# Altium project qfc_Alfa2.0.PrjPcb
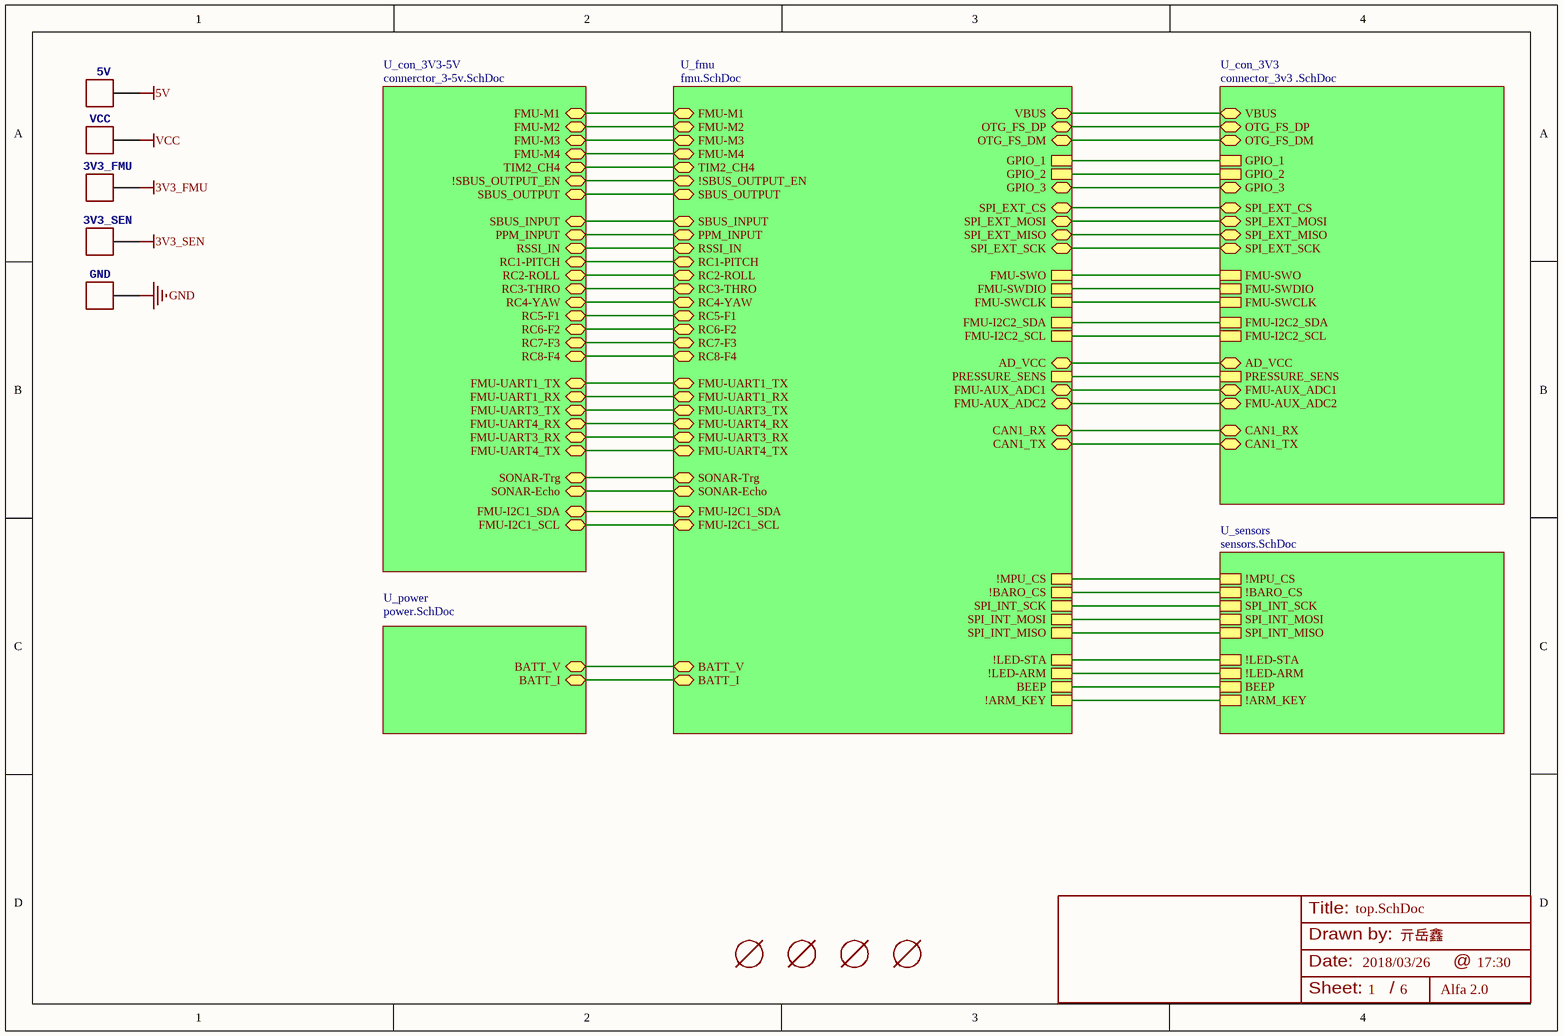
[diagram p0: top.SchDoc]
6 sheets, 137 parts. Net scope: hierarchical (ports join the sheet entries above them; power ports are global).
Board file: qfc_Alfa2.0.PcbDoc
Sheets:
  top.SchDoc
    U_fmu = fmu.SchDoc
    U_sensors = sensors.SchDoc
    U_power = power.SchDoc
    U_con_3V3 = connector_3v3 .SchDoc
    U_con_3V3-5V = connerctor_3-5v.SchDoc

## Sheet top.SchDoc: myA4
size A4; Date: 2018/03/26; DrawnBy: 亓岳鑫; Organization: Altium Limited; Address1: 3 Minna Close; Address2: Belrose; Address3: NSW 2085; Address4: Australia; DocumentNumber: 1; Revision: Alfa 2.0; SheetNumber: 1; SheetTotal: 6; Time: 17:30

### Parts
3V3_FMU  TEST  [PAD.04X.04]  (value not drawn)
3V3_SEN  TEST  [PAD.04X.04]  (value not drawn)
5V  TEST  [PAD.04X.04]  (value not drawn)
GND  TEST  [PAD.04X.04]  (value not drawn)
M101  MOUNT-HOLE3MM  [HOLE-3mm]  (value not drawn)
M102  MOUNT-HOLE3MM  [HOLE-3mm]  (value not drawn)
M103  MOUNT-HOLE3MM  [HOLE-3mm]  (value not drawn)
M104  MOUNT-HOLE3MM  [HOLE-3mm]  (value not drawn)
VCC  TEST  [PAD.04X.04]  (value not drawn)

### Sub-sheets
U_con_3V3 = connector_3v3 .SchDoc: FMU-SWCLK, FMU-SWDIO, FMU-SWO, GPIO_1, OTG_FS_DP, OTG_FS_DM, GPIO_2, VBUS, SPI_EXT_MOSI, SPI_EXT_MISO, SPI_EXT_SCK, CAN1_RX, CAN1_TX, SPI_EXT_CS, PRESSURE_SENS, FMU-I2C2_SDA, FMU-I2C2_SCL, FMU-AUX_ADC1, FMU-AUX_ADC2, AD_VCC, GPIO_3
U_con_3V3-5V = connerctor_3-5v.SchDoc: FMU-M1, FMU-M2, FMU-M3, FMU-M4, PPM_INPUT, SBUS_INPUT, SBUS_OUTPUT, !SBUS_OUTPUT_EN, RSSI_IN, FMU-UART1_TX, FMU-UART1_RX, FMU-UART3_TX, FMU-UART4_RX, FMU-UART3_RX, FMU-UART4_TX, RC5-F1, RC3-THRO, RC1-PITCH, RC4-YAW, RC2-ROLL, RC6-F2, RC7-F3, RC8-F4, SONAR-Echo, TIM2_CH4, FMU-I2C1_SDA, FMU-I2C1_SCL, SONAR-Trg
U_fmu = fmu.SchDoc: BATT_I, BATT_V, FMU-M1, FMU-M2, FMU-M3, FMU-M4, PPM_INPUT, SBUS_INPUT, SBUS_OUTPUT, !SBUS_OUTPUT_EN, RSSI_IN, FMU-UART1_TX, FMU-UART1_RX, FMU-UART3_TX, FMU-UART4_RX, FMU-UART3_RX, FMU-UART4_TX, RC5-F1, RC3-THRO, RC1-PITCH, RC4-YAW, RC2-ROLL, RC6-F2, RC7-F3, RC8-F4, SONAR-Echo, TIM2_CH4, FMU-I2C1_SDA, FMU-I2C1_SCL, SONAR-Trg, FMU-SWCLK, FMU-SWDIO, FMU-SWO, GPIO_1, OTG_FS_DP, OTG_FS_DM, GPIO_2, VBUS, SPI_EXT_MOSI, SPI_EXT_MISO, SPI_EXT_SCK, CAN1_RX, CAN1_TX, SPI_EXT_CS, PRESSURE_SENS, FMU-I2C2_SDA, FMU-I2C2_SCL, FMU-AUX_ADC1, FMU-AUX_ADC2, AD_VCC, GPIO_3, !MPU_CS, !BARO_CS, SPI_INT_SCK, SPI_INT_MOSI, SPI_INT_MISO, !LED-STA, !LED-ARM, !ARM_KEY, BEEP
U_power = power.SchDoc: BATT_I, BATT_V
U_sensors = sensors.SchDoc: !MPU_CS, !BARO_CS, SPI_INT_SCK, SPI_INT_MOSI, SPI_INT_MISO, !LED-STA, !LED-ARM, !ARM_KEY, BEEP

### Nets
3V3_FMU: 3V3_FMU.P$1
3V3_SEN: 3V3_SEN.P$1
5V: 5V.P$1
GND: GND.P$1
VCC: VCC.P$1
PPM_INPUT: sheet U_fmu/PPM_INPUT, sheet U_con_3V3-5V/PPM_INPUT
SPI1_MISO: sheet U_fmu/SPI_INT_SCK, sheet U_sensors/SPI_INT_SCK
SPI1_MOSI: sheet U_fmu/SPI_INT_MOSI, sheet U_sensors/SPI_INT_MOSI
SPI1_SCK: sheet U_fmu/SPI_INT_MISO, sheet U_sensors/SPI_INT_MISO
NetC501_P$1: sheet U_fmu/AD_VCC, sheet U_con_3V3/AD_VCC
NetC502_P$1: sheet U_fmu/PRESSURE_SENS, sheet U_con_3V3/PRESSURE_SENS
NetC503_P$1: sheet U_fmu/FMU-AUX_ADC1, sheet U_con_3V3/FMU-AUX_ADC1
NetC504_P$1: sheet U_fmu/FMU-AUX_ADC2, sheet U_con_3V3/FMU-AUX_ADC2
NetD501_C: sheet U_fmu/VBUS, sheet U_con_3V3/VBUS
NetJ502_1: sheet U_fmu/SPI_EXT_CS, sheet U_con_3V3/SPI_EXT_CS
NetJ502_2: sheet U_fmu/SPI_EXT_MOSI, sheet U_con_3V3/SPI_EXT_MOSI
NetJ502_3: sheet U_fmu/SPI_EXT_MISO, sheet U_con_3V3/SPI_EXT_MISO
NetJ502_4: sheet U_fmu/SPI_EXT_SCK, sheet U_con_3V3/SPI_EXT_SCK
NetJ505_2: sheet U_fmu/FMU-SWCLK, sheet U_con_3V3/FMU-SWCLK
NetJ505_3: sheet U_fmu/FMU-SWO, sheet U_con_3V3/FMU-SWO
NetJ505_4: sheet U_fmu/FMU-SWDIO, sheet U_con_3V3/FMU-SWDIO
NetJ506_1: sheet U_fmu/GPIO_1, sheet U_con_3V3/GPIO_1
NetJ506_2: sheet U_fmu/GPIO_2, sheet U_con_3V3/GPIO_2
NetJ506_3: sheet U_fmu/GPIO_3, sheet U_con_3V3/GPIO_3
NetJ602_1: sheet U_fmu/SONAR-Trg, sheet U_con_3V3-5V/SONAR-Trg
NetR201_2: sheet U_fmu/BATT_V, sheet U_power/BATT_V
NetR202_2: sheet U_fmu/BATT_I, sheet U_power/BATT_I
NetR301_1: sheet U_fmu/!ARM_KEY, sheet U_sensors/!ARM_KEY
NetR302_1: sheet U_fmu/!LED-ARM, sheet U_sensors/!LED-ARM
NetR303_1: sheet U_fmu/!LED-STA, sheet U_sensors/!LED-STA
NetR306_2: sheet U_fmu/BEEP, sheet U_sensors/BEEP
NetR502_1: sheet U_fmu/FMU-I2C2_SCL, sheet U_con_3V3/FMU-I2C2_SCL
NetR503_1: sheet U_fmu/OTG_FS_DM, sheet U_con_3V3/OTG_FS_DM
NetR504_1: sheet U_fmu/FMU-I2C2_SDA, sheet U_con_3V3/FMU-I2C2_SDA
NetR505_1: sheet U_fmu/OTG_FS_DP, sheet U_con_3V3/OTG_FS_DP
NetR604_1: sheet U_fmu/RSSI_IN, sheet U_con_3V3-5V/RSSI_IN
NetU301_8: sheet U_fmu/!MPU_CS, sheet U_sensors/!MPU_CS
NetU302_5: sheet U_fmu/!BARO_CS, sheet U_sensors/!BARO_CS
NetU401_23: sheet U_fmu/FMU-UART4_TX, sheet U_con_3V3-5V/FMU-UART4_TX
NetU401_24: sheet U_fmu/FMU-UART4_RX, sheet U_con_3V3-5V/FMU-UART4_RX
NetU401_25: sheet U_fmu/SONAR-Echo, sheet U_con_3V3-5V/SONAR-Echo
NetU401_26: sheet U_fmu/TIM2_CH4, sheet U_con_3V3-5V/TIM2_CH4
NetU401_35: sheet U_fmu/RC3-THRO, sheet U_con_3V3-5V/RC3-THRO
NetU401_36: sheet U_fmu/RC4-YAW, sheet U_con_3V3-5V/RC4-YAW
NetU401_40: sheet U_fmu/FMU-M1, sheet U_con_3V3-5V/FMU-M1
NetU401_42: sheet U_fmu/FMU-M2, sheet U_con_3V3-5V/FMU-M2
NetU401_44: sheet U_fmu/FMU-M3, sheet U_con_3V3-5V/FMU-M3
NetU401_45: sheet U_fmu/FMU-M4, sheet U_con_3V3-5V/FMU-M4
NetU401_55: sheet U_fmu/FMU-UART3_TX, sheet U_con_3V3-5V/FMU-UART3_TX
NetU401_56: sheet U_fmu/FMU-UART3_RX, sheet U_con_3V3-5V/FMU-UART3_RX
NetU401_59: sheet U_fmu/RC5-F1, sheet U_con_3V3-5V/RC5-F1
NetU401_60: sheet U_fmu/RC6-F2, sheet U_con_3V3-5V/RC6-F2
NetU401_61: sheet U_fmu/RC7-F3, sheet U_con_3V3-5V/RC7-F3
NetU401_62: sheet U_fmu/RC8-F4, sheet U_con_3V3-5V/RC8-F4
NetU401_81: sheet U_fmu/CAN1_RX, sheet U_con_3V3/CAN1_RX
NetU401_82: sheet U_fmu/CAN1_TX, sheet U_con_3V3/CAN1_TX
NetU401_84: sheet U_fmu/!SBUS_OUTPUT_EN, sheet U_con_3V3-5V/!SBUS_OUTPUT_EN
NetU401_86: sheet U_fmu/SBUS_OUTPUT, sheet U_con_3V3-5V/SBUS_OUTPUT
NetU401_87: sheet U_fmu/SBUS_INPUT, sheet U_con_3V3-5V/SBUS_INPUT
NetU401_90: sheet U_fmu/RC1-PITCH, sheet U_con_3V3-5V/RC1-PITCH
NetU401_91: sheet U_fmu/RC2-ROLL, sheet U_con_3V3-5V/RC2-ROLL
NetU401_92: sheet U_fmu/FMU-UART1_TX, sheet U_con_3V3-5V/FMU-UART1_TX
NetU401_93: sheet U_fmu/FMU-UART1_RX, sheet U_con_3V3-5V/FMU-UART1_RX
NetU401_95: sheet U_fmu/FMU-I2C1_SCL, sheet U_con_3V3-5V/FMU-I2C1_SCL
NetU401_96: sheet U_fmu/FMU-I2C1_SDA, sheet U_con_3V3-5V/FMU-I2C1_SDA

### Notes on the sheet
- Title:
- Drawn by:
- Date:
- @
- Sheet:
- /

### Library data of the parts
3V3_FMU 3V3_SEN 5V GND VCC = TEST: BOM: EXCLUDE; PARTNO: *
M101-M104 = MOUNT-HOLE3MM: BOM: EXCLUDE; PARTNO: *

## Sheet fmu.SchDoc: myA4
size A4; Date: 2018/03/30; DrawnBy: 亓岳鑫; Organization: Altium Limited; Address1: 3 Minna Close; Address2: Belrose; Address3: NSW 2085; Address4: Australia; DocumentNumber: 4; Revision: Alfa 2.0; SheetNumber: 4; SheetTotal: 6; Time: 17:30
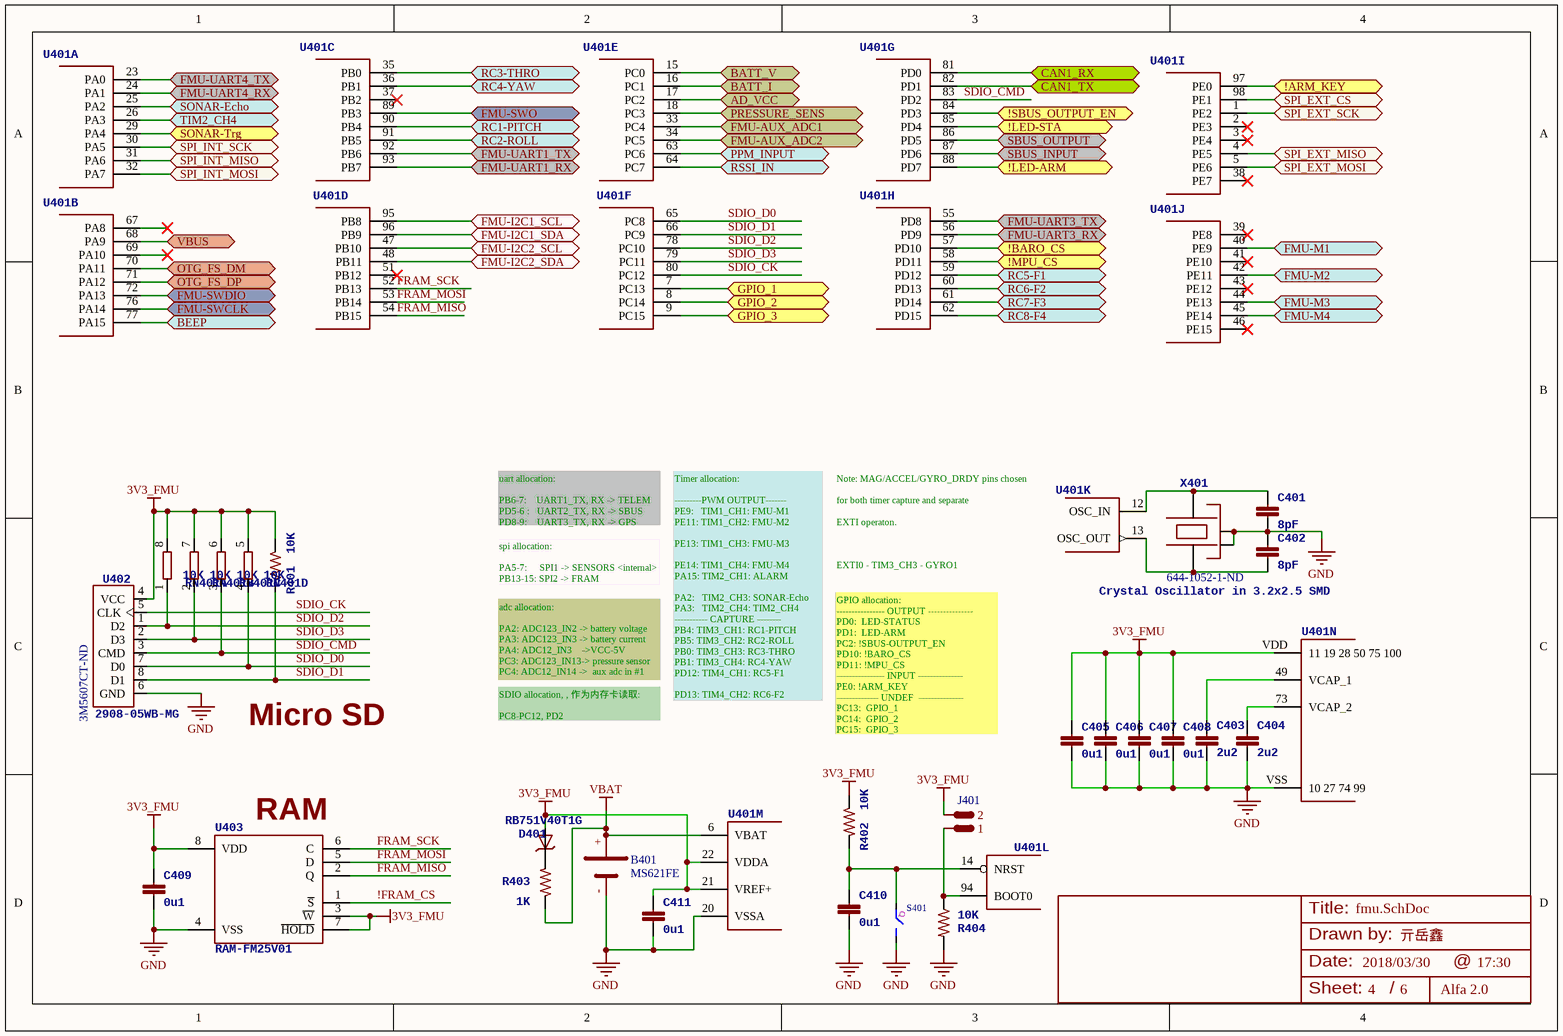
[diagram p1: fmu.SchDoc]

### Parts
B401  MS621FE  [MS621FE]
C401  8pF  [0603-CAP]
C402  8pF  [0603-CAP]
C403  2u2  [0603-CAP]
C404  2u2  [0603-CAP]
C405  0u1  [0603-CAP]
C406  0u1  [0603-CAP]
C407  0u1  [0603-CAP]
C408  0u1  [0603-CAP]
C409  0u1  [0603-CAP]
C410  0u1  [0603-CAP]
C411  0u1  [0603-CAP]
D401  RB751V40T1G  [SOD-323]
J401  HDR 2X1  [HDR2X1]  (value not drawn)
R401  10K  [0603-RES]
R402  10K  [0603-RES]
R403  1K  [0603-RES]
R404  10K  [0603-RES]
RN401  10K  [0603*4]  (parts A,B,C,D of 4)
S401  轻触开关 贴片3*6*2.5mm  [SMD-SWITCH-2P]  (value not drawn)
U401  STM32F427VI qfp 100 pin  [LQFP100]  (value not drawn)  (parts A,B,C,D,E,F,G,H,I,J,K,L,M,N of 14)
U402  2908-05WB-MG  Supplier Part Number 1: 3M5607CT-ND  [MICROSD]
U403  RAM-FM25V01  [SO08]
X401  Crystal Oscillator in 3.2x2.5 SMD  Supplier Part Number 1: 644-1052-1-ND  [3225-OSC]

### Ports
!ARM_KEY, !BARO_CS, !LED-ARM, !LED-STA, !MPU_CS, !SBUS_OUTPUT_EN, AD_VCC, BATT_I, BATT_V, BEEP, CAN1_RX, CAN1_TX, FMU-AUX_ADC1, FMU-AUX_ADC2, FMU-I2C1_SCL, FMU-I2C1_SDA, FMU-I2C2_SCL, FMU-I2C2_SDA, FMU-M1, FMU-M2, FMU-M3, FMU-M4, FMU-SWCLK, FMU-SWDIO, FMU-SWO, FMU-UART1_RX, FMU-UART1_TX, FMU-UART3_RX, FMU-UART3_TX, FMU-UART4_RX, FMU-UART4_TX, GPIO_1, GPIO_2, GPIO_3, OTG_FS_DM, OTG_FS_DP, PPM_INPUT, PRESSURE_SENS, RC1-PITCH, RC2-ROLL, RC3-THRO, RC4-YAW, RC5-F1, RC6-F2, RC7-F3, RC8-F4, RSSI_IN, SBUS_INPUT, SBUS_OUTPUT, SONAR-Echo, SONAR-Trg, SPI_EXT_CS, SPI_EXT_MISO, SPI_EXT_MOSI, SPI_EXT_SCK, SPI_INT_MISO, SPI_INT_MOSI, SPI_INT_SCK, TIM2_CH4, VBUS

### Nets
3V3_FMU: C405.P$1 C406.P$1 C407.P$1 C408.P$1 C409.P$1 C411.P$1 D401.A J401.2 R401.1 R402.1 RN401.5 RN401.6 RN401.7 RN401.8 U401.21(VREF+) U401.22(VDDA) U401.VDD(11_19_28_50_75_100) U402.4(VCC) U403.3(~{W}) U403.7(~{HOLD}) U403.8(VDD)
GND: B401.- C401.P$2 C402.P$1 C403.P$2 C404.P$2 C405.P$2 C406.P$2 C407.P$2 C408.P$2 C409.P$2 C410.P$2 C411.P$2 R404.2 S401.2 U401.20(VSSA) U401.VSS(10_27_74_99) U402.6(GND) U403.4(VSS) X401.2(NC_2) X401.4(NC_4)
VBAT: B401.+ R403.1 U401.6(VBAT)
!FRAM_CS: U403.1(~{S})
FRAM_MISO: U401.54(PB15) U403.2(Q)
FRAM_MOSI: U401.53(PB14) U403.5(D)
FRAM_SCK: U401.52(PB13) U403.6(C)
PPM_INPUT: U401.63(PC6) ; port PPM_INPUT
SDIO_CK: U401.80(PC12) U402.5(CLK)
SDIO_CMD: RN401.3 U401.83(PD2) U402.3(CMD)
SDIO_D0: RN401.4 U401.65(PC8) U402.7(D0)
SDIO_D1: R401.2 U401.66(PC9) U402.8(D1)
SDIO_D2: RN401.1 U401.78(PC10) U402.1(D2)
SDIO_D3: RN401.2 U401.79(PC11) U402.2(D3)
SPI1_MISO: U401.30(PA5) ; port SPI_INT_SCK
SPI1_MOSI: U401.32(PA7) ; port SPI_INT_MOSI
SPI1_SCK: U401.31(PA6) ; port SPI_INT_MISO
NetC401_P$1: C401.P$1 U401.12(OSC_IN) X401.3
NetC402_P$2: C402.P$2 U401.13(OSC_OUT) X401.1
NetC403_P$1: C403.P$1 U401.49(VCAP_1)
NetC404_P$1: C404.P$1 U401.73(VCAP_2)
NetC410_P$1: C410.P$1 R402.2 S401.1 U401.14(NRST)
NetC501_P$1: U401.17(PC2) ; port AD_VCC
NetC502_P$1: U401.18(PC3) ; port PRESSURE_SENS
NetC503_P$1: U401.33(PC4) ; port FMU-AUX_ADC1
NetC504_P$1: U401.34(PC5) ; port FMU-AUX_ADC2
NetD401_C: D401.C R403.2
NetD501_C: U401.68(PA9) ; port VBUS
NetJ401_1: J401.1 R404.1 U401.94(BOOT0)
NetJ502_1: U401.98(PE1) ; port SPI_EXT_CS
NetJ502_2: U401.5(PE6) ; port SPI_EXT_MOSI
NetJ502_3: U401.4(PE5) ; port SPI_EXT_MISO
NetJ502_4: U401.1(PE2) ; port SPI_EXT_SCK
NetJ505_2: U401.76(PA14) ; port FMU-SWCLK
NetJ505_3: U401.89(PB3) ; port FMU-SWO
NetJ505_4: U401.72(PA13) ; port FMU-SWDIO
NetJ506_1: U401.7(PC13) ; port GPIO_1
NetJ506_2: U401.8(PC14) ; port GPIO_2
NetJ506_3: U401.9(PC15) ; port GPIO_3
NetJ602_1: U401.29(PA4) ; port SONAR-Trg
NetR201_2: U401.15(PC0) ; port BATT_V
NetR202_2: U401.16(PC1) ; port BATT_I
NetR301_1: U401.97(PE0) ; port !ARM_KEY
NetR302_1: U401.88(PD7) ; port !LED-ARM
NetR303_1: U401.85(PD4) ; port !LED-STA
NetR306_2: U401.77(PA15) ; port BEEP
NetR502_1: U401.47(PB10) ; port FMU-I2C2_SCL
NetR503_1: U401.70(PA11) ; port OTG_FS_DM
NetR504_1: U401.48(PB11) ; port FMU-I2C2_SDA
NetR505_1: U401.71(PA12) ; port OTG_FS_DP
NetR604_1: U401.64(PC7) ; port RSSI_IN
NetU301_8: U401.58(PD11) ; port !MPU_CS
NetU302_5: U401.57(PD10) ; port !BARO_CS
NetU401_23: U401.23(PA0) ; port FMU-UART4_TX
NetU401_24: U401.24(PA1) ; port FMU-UART4_RX
NetU401_25: U401.25(PA2) ; port SONAR-Echo
NetU401_26: U401.26(PA3) ; port TIM2_CH4
NetU401_35: U401.35(PB0) ; port RC3-THRO
NetU401_36: U401.36(PB1) ; port RC4-YAW
NetU401_40: U401.40(PE9) ; port FMU-M1
NetU401_42: U401.42(PE11) ; port FMU-M2
NetU401_44: U401.44(PE13) ; port FMU-M3
NetU401_45: U401.45(PE14) ; port FMU-M4
NetU401_55: U401.55(PD8) ; port FMU-UART3_TX
NetU401_56: U401.56(PD9) ; port FMU-UART3_RX
NetU401_59: U401.59(PD12) ; port RC5-F1
NetU401_60: U401.60(PD13) ; port RC6-F2
NetU401_61: U401.61(PD14) ; port RC7-F3
NetU401_62: U401.62(PD15) ; port RC8-F4
NetU401_81: U401.81(PD0) ; port CAN1_RX
NetU401_82: U401.82(PD1) ; port CAN1_TX
NetU401_84: U401.84(PD3) ; port !SBUS_OUTPUT_EN
NetU401_86: U401.86(PD5) ; port SBUS_OUTPUT
NetU401_87: U401.87(PD6) ; port SBUS_INPUT
NetU401_90: U401.90(PB4) ; port RC1-PITCH
NetU401_91: U401.91(PB5) ; port RC2-ROLL
NetU401_92: U401.92(PB6) ; port FMU-UART1_TX
NetU401_93: U401.93(PB7) ; port FMU-UART1_RX
NetU401_95: U401.95(PB8) ; port FMU-I2C1_SCL
NetU401_96: U401.96(PB9) ; port FMU-I2C1_SDA

Not connected (* = marked no-connect by the designer): U401 2(PE3)* 3(PE4)* 37(PB2)* 38(PE7)* 39(PE8)* 41(PE10)* 43(PE12)* 46(PE15)* 51(PB12)* 67(PA8)* 69(PA10)*

### Notes on the sheet
- uart allocation:
  PB6-7:    UART1_TX, RX -> TELEM
  PD5-6 :   UART2_TX, RX -> SBUS
  PD8-9:    UART3_TX, RX -> GPS
  PA0-1 :   UART4_TX, RX -> DEBUG
- spi allocation:
  PA5-7:     SPI1 -> SENSORS <internal>
  PB13-15: SPI2 -> FRAM
  PE2,5,6:  SPI4 -> external SPI
- Note: MAG/ACCEL/GYRO_DRDY pins chosen
  for both timer capture and separate
  EXTI operaton.
  EXTI0 - TIM3_CH3 - GYRO1
  EXTI1 - <free>
  EXTI2 - <free>
  EXTI3 - <free>
  EXTI4 - TIM3_CH1 - ACCEL
  EXTI5-9 - TIM3_CH2 - MAG
- adc allocation:
  PA2: ADC123_IN2 -> battery voltage
  PA3: ADC123_IN3 -> battery current
  PA4: ADC12_IN3    ->VCC-5V
  PC3: ADC123_IN13-> pressure sensor
  PC4: ADC12_IN14 ->  aux adc in #1
  PC5: ADC12_IN15  -> aux adc in #2
- SDIO allocation, , 作为内存卡读取:
  PC8-PC12, PD2
- Timer allocation:
  ---------PWM OUTPUT-------
  PE9:   TIM1_CH1: FMU-M1
  PE11: TIM1_CH2: FMU-M2
  PE13: TIM1_CH3: FMU-M3
  PE14: TIM1_CH4: FMU-M4
  PA15: TIM2_CH1: ALARM
  PA2:   TIM2_CH3: SONAR-Echo
  PA3:   TIM2_CH4: TIM2_CH4
  ----------- CAPTURE --------
  PB4: TIM3_CH1: RC1-PITCH
  PB5: TIM3_CH2: RC2-ROLL
  PB0: TIM3_CH3: RC3-THRO
  PB1: TIM3_CH4: RC4-YAW
  PD12: TIM4_CH1: RC5-F1
  PD13: TIM4_CH2: RC6-F2
  PD14: TIM4_CH3: RC7-F3
  PD15: TIM4_CH4: RC8-F4
  PC6: TIM8_CH1:PPM_IN
  PC7: TIM8_CH2:RSSI_IN
- Micro SD
- GPIO allocation:
  ---------------- OUTPUT ---------------
  PD0:  LED-STATUS
  PD1:  LED-ARM
  PC2: !SBUS-OUTPUT_EN
  PD10: !BARO_CS
  PD11: !MPU_CS
  ---------------- INPUT ---------------
  PE0: !ARM_KEY
  -------------- UNDEF  ---------------
  PC13:  GPIO_1
  PC14:  GPIO_2
  PC15:  GPIO_3
- (near U403) RAM
- Title:
- Drawn by:
- Date:
- @
- Sheet:
- /
- (in symbol SWITCH-1) Q

### Library data of the parts
B401 = BAT-MS621FE: MS Lithium Rechargeable Battery; Supplier 1: Digi-Key; Supplier Part Number 1: 728-1057-ND
C401 C402 = CAP0603-8pF: CAP CER 8PF 50v c0g 0603; Value: 8pF; Supplier 1: Digi-Key; Supplier Part Number 1: 445-5043-1-ND
C403 C404 = CAP0603-2.2uF: Capacitor, 2.2uF, 16V, 10%, X6S, 0603, Ceramic; PARTNO: C1608X6S1C225K080AC; 3DR_PARTNO: ECM0619; Supplier 1: Digi-Key; Value: 2u2; Supplier Part Number 1: 445-7438-1-ND
C405-C411 = CAP0603-0.1uF: Capacitor, 0.1uF, 16V, Y5V, 0402, Ceramic; PARTNO: CC0402ZRY5V7BB104; 3DR_PARTNO: ECM0700; Value: 0u1; Supplier 1: Digi-Key; Supplier Part Number 1: 311-1776-1-ND
D401 = DIODE-SBD_SOD323: DIODE SCHOTTKY 40V 30mA , 0.34V, SOD323; Value: 20V 1A; Supplier 1: Digi-Key; Supplier Part Number 1: NSVRB751V40T1GOSCT-ND
J401 = HDR 2X1: 排针, 2X1 pins
R401 R402 R404 = RES0603-10K: RES 10K OHM 1/10W 5% 0603; Value: 10K; Supplier 1: Digi-Key; Supplier Part Number 1: A126331TR-ND
R403 = RES0603-1K: RES 1K OHM 1/10W 5% 0603; Value: 1K; Supplier 1: Digi-Key; Supplier Part Number 1: 311-1.0KGRCT-ND
RN401 = RES4P-0603-10K: RES ARRAY 10K OHM 4 RES 0603; Value: 10K; Supplier 1: Digi-Key; Supplier Part Number 1: CAY16-22R0F4LFCT-ND
S401 = SWITCH-1: 按键 3*6*2.5mm 轻触开关 贴片2脚 白色; Revision: July-2002: Re-released for DXP Platform.
U401 = STM32F4X7VX: REV 3 Silicon or later IC MCU ARM 2MB FLASH 100LQFP; 3DR_PARTNO: ECM0841; Supplier 1: Digi-Key; Supplier Part Number 1: 497-14049-ND
U402 = MICROSD-SDI: CONN MICRO SD CARD PUSH-PUSH R/A; 3DR_PARTNO: ECM0485; PARTNO: 2908-05WB-MG; Supplier 1: Digi-Key
U403 = RAM-FM25V01: IC FRAM 128KBIT 40MHZ 8SOIC; PARTNO: FM25V01-G; 3DR_PARTNO: ECM0826; Value: 128k; DATASHEET: http://www.ramtron.com/files/datasheets/FM25V01_ds.pdf; LINK: http://www.digikey.com/product-detail/en/FM25V01-GTR/1140-1026-1-ND/2809832; MFGPN: FM25V01; Supplier 1: Digi-Key; Supplier Part Number 1: 428-3211-ND
X401 = OSCILLATOR-3225: CRYSTAL 24MHZ 8PF SMD; 3DR_PARTNO: ECM0708; PARTNO: NX3225SA-24.000MHZ-STD-CSR-1; Supplier 1: Digi-Key; Value: 24MHz

## Sheet sensors.SchDoc: myA4
size A4; Date: 2018/03/30; DrawnBy: 亓岳鑫; Organization: Altium Limited; Address1: 3 Minna Close; Address2: Belrose; Address3: NSW 2085; Address4: Australia; DocumentNumber: 3; Revision: Alfa 2.0; SheetNumber: 3; SheetTotal: 6; Time: 17:30
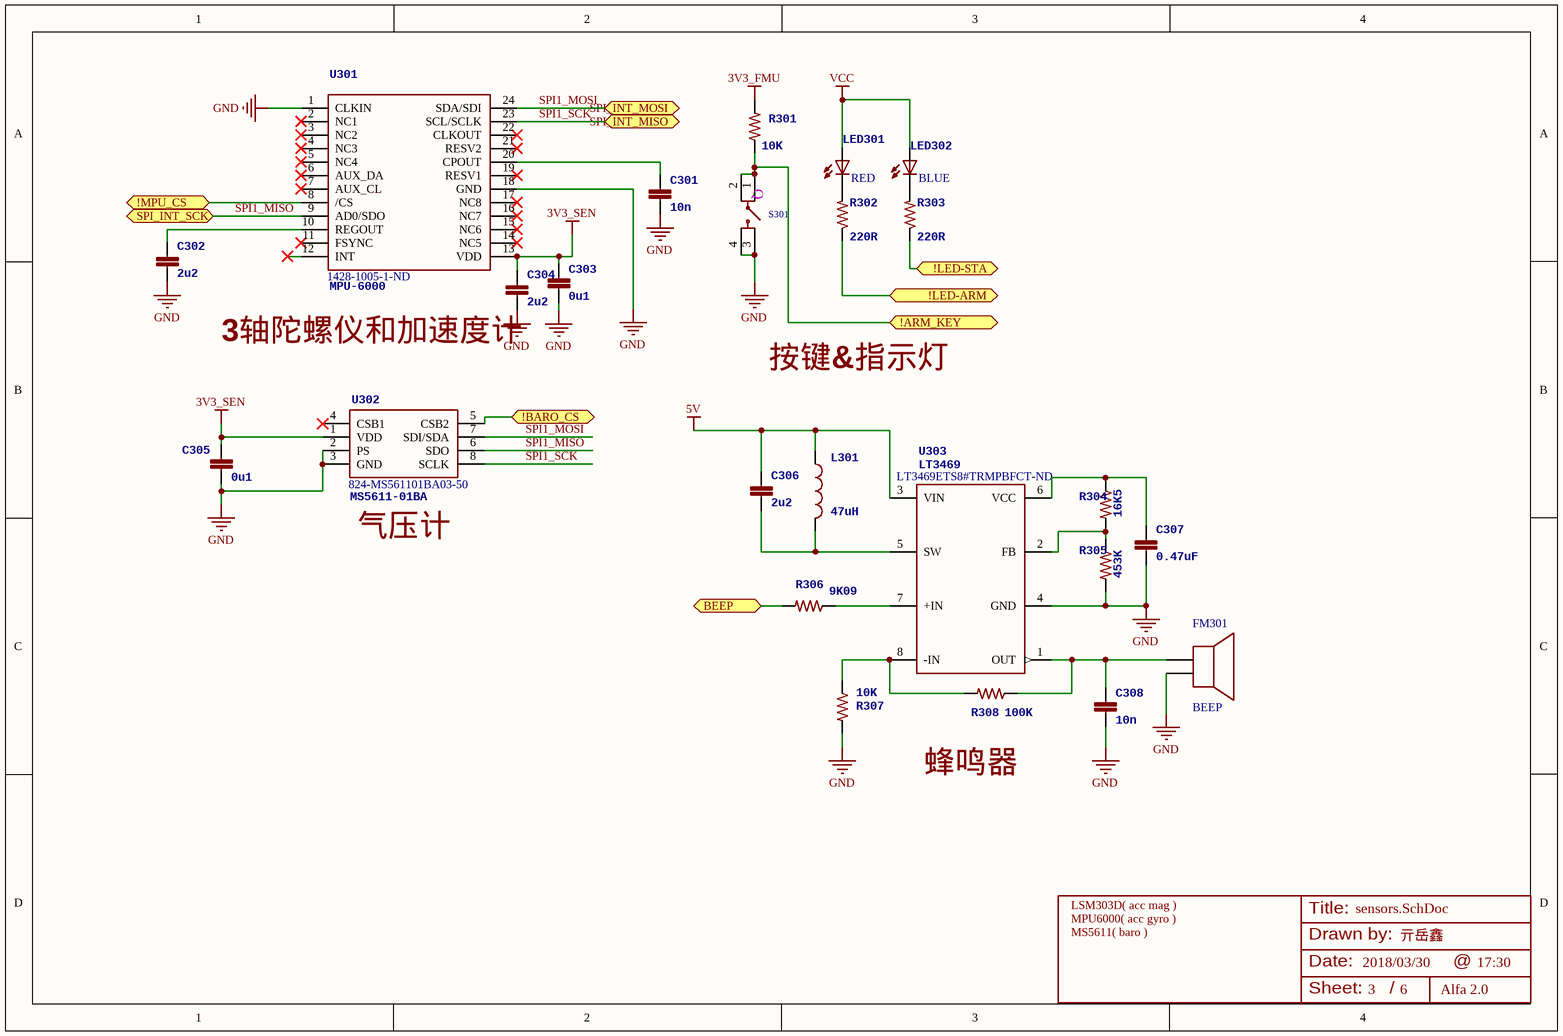
[diagram p2: sensors.SchDoc]

### Parts
C301  10n  [0603-CAP]
C302  2u2  [0603-CAP]
C303  0u1  [0603-CAP]
C304  2u2  [0603-CAP]
C305  0u1  [0603-CAP]
C306  2u2  [0603-CAP]
C307  0.47uF  [0603-CAP]
C308  10n  [0603-CAP]
FM301  BEEP  [BEEP-12mm]
L301  47uH  [1210 - IND]
LED301  Color: RED  [0603-LED]  (hidden comment: APT1608SECK)
LED302  Color: BLUE  [0603-LED]  (hidden comment: APT1608QBC/G)
R301  10K  [0603-RES]
R302  220R  [0603-RES]
R303  220R  [0603-RES]
R304  16K5  [0603-RES]
R305  453K  [0603-RES]
R306  9K09  [0603-RES]
R307  10K  [0603-RES]
R308  100K  [0603-RES]
S301  SWITCH  [SW_6*6]  (value not drawn)
U301  MPU-6000  Supplier Part Number 1: 1428-1005-1-ND  [QFN-24]
U302  MS5611-01BA  Supplier Part Number 1: 824-MS561101BA03-50  [MS5611-01BA]
U303  LT3469  Supplier Part Number 1: LT3469ETS8#TRMPBFCT-ND  [SOT23-8]

### Ports
!ARM_KEY, !BARO_CS, !LED-ARM, !LED-STA, !MPU_CS, BEEP, SPI_INT_MISO, SPI_INT_MOSI, SPI_INT_SCK

### Nets
3V3_FMU: R301.2
3V3_SEN: C303.P$1 C304.P$1 C305.P$1 U301.13(VDD) U302.1(VDD)
5V: C306.P$1 L301.1 U303.3(VIN)
GND: C301.P$2 C302.P$2 C303.P$2 C304.P$2 C305.P$2 C307.P$2 C308.P$2 FM301.2 R305.2 R307.2 S301.3 S301.4 U301.1(CLKIN) U301.18(GND) U302.2(PS) U302.3(GND) U303.4(GND)
VCC: LED301.A LED302.A
SPI1_MISO: U301.9(AD0/SDO) U302.6(SDO) ; port SPI_INT_SCK
SPI1_MOSI: U301.24(SDA/SDI) U302.7(SDI/SDA) ; port SPI_INT_MOSI
SPI1_SCK: U301.23(SCL/SCLK) U302.8(SCLK) ; port SPI_INT_MISO
NetC301_P$1: C301.P$1 U301.20(CPOUT)
NetC302_P$1: C302.P$1 U301.10(REGOUT)
NetC306_P$2: C306.P$2 L301.2 U303.5(SW)
NetC307_P$1: C307.P$1 R304.1 U303.6(VCC)
NetC308_P$1: C308.P$1 FM301.1 R308.1 U303.1(OUT)
NetLED301_C: LED301.C R302.2
NetLED302_C: LED302.C R303.2
NetR301_1: R301.1 S301.1 S301.2 ; port !ARM_KEY
NetR302_1: R302.1 ; port !LED-ARM
NetR303_1: R303.1 ; port !LED-STA
NetR304_2: R304.2 R305.1 U303.2(FB)
NetR306_1: R306.1 U303.7(+IN)
NetR306_2: R306.2 ; port BEEP
NetR307_1: R307.1 R308.2 U303.8(-IN)
NetU301_8: U301.8(/CS) ; port !MPU_CS
NetU302_5: U302.5(CSB2) ; port !BARO_CS

Not connected (* = marked no-connect by the designer): U301 2(NC1)* 3(NC2)* 4(NC3)* 5(NC4)* 6(AUX_DA)* 7(AUX_CL)* 11(FSYNC)* 12(INT) 14(NC5)* 15(NC6)* 16(NC7)* 17(NC8)* 19(RESV1)* 21(RESV2)* 22(CLKOUT)*; U302 4(CSB1)*

### Notes on the sheet
- 3轴陀螺仪和加速度计
- 按键&指示灯
- (near U302) 气压计
- (near R308) 蜂鸣器
- LSM303D( acc mag )
- MPU6000( acc gyro )
- MS5611( baro )
- Title:
- Drawn by:
- Date:
- @
- Sheet:
- /
- (in symbol SWITCH) Q

### Library data of the parts
C301 C308 = CAP0603-10nF: Capacitor, 10nF, 50V; PARTNO: CC0402ZRY5V7BB104; 3DR_PARTNO: ECM0700; Value: 10n
C302 C304 C306 = CAP0603-2.2uF: as C403 on sheet fmu; Supplier 1: Digi-Key; Value: 2u2; Supplier Part Number 1: 445-7438-1-ND
C303 C305 = CAP0603-0.1uF: as C405 on sheet fmu; Value: 0u1; Supplier 1: Digi-Key; Supplier Part Number 1: 311-1776-1-ND
C307 = CAP0603-0.47uF: Capacitor, 0.47uF, 16V, 10%, X6S, 0603, Ceramic; 3DR_PARTNO: ECM0619; Value: 0.47uF
FM301 = BEEP: 蜂鸣器; 驱动芯片: LT3469
L301 = INDUCTOR-1210: 贴片功率电感，绕线工字电感; PARTNO: LQH32CN470, 1.3Ω; 3DR_PARTNO: ECM0814; Value: 47UH; PARTNO2: LBC2518T470M,  1.9Ω; Supplier 1: Digi-Key; Supplier 2: Digi-Key; Supplier Part Number 1: 490-2497-1-ND; Supplier Part Number 2: 587-5881-1-ND
LED301 = LED0603-RED: 2.2v, LED RED CLEAR 0603 SMD; 3DR_PARTNO: ECM0515; PARTNO: APT1608SECK; Supplier 1: Digi-Key; Supplier Part Number 1: 754-1786-1-ND
LED302 = LED0603-BLUE: 3.3v, LED BLUE CLEAR 0603 SMD; 3DR_PARTNO: ECM0515; PARTNO: APT1608QBC/G; Supplier 1: Digi-Key; Supplier Part Number 1: 754-1501-2-ND
R301 R307 = RES0603-10K: RES 10K OHM 1/10W 5% 0603; Value: 10K; Supplier 1: Digi-Key; Supplier Part Number 1: A126331TR-ND
R302 R303 = RES0603-220R: RES 220R OHM 1/10W 5% 0603; Value: 220R; Supplier 1: Digi-Key; Supplier Part Number 1: 311-220GRCT-ND
R304 = RES0603-16K5: RES 16K5 OHM 1/10W 5% 0603; Value: 16K5; Supplier 1: Digi-Key; Supplier Part Number 1: 311-16.5KHRCT-ND
R305 = RES0603-453K: RES 453K OHM 1/10W 5% 0603; Value: 453K; Supplier 1: Digi-Key; Supplier Part Number 1: 311-453KHRCT-ND
R306 = RES0603-9K09: RES 9K09 OHM 1/10W 5% 0603; Value: 9K09; Supplier 1: Digi-Key; Supplier Part Number 1: 311-9.09KDCT-ND
R308 = RES0603-100K: RES 100K OHM 1/10W 5% 0603; Value: 100K; Supplier 1: Digi-Key; Supplier Part Number 1: 311-100KGRCT-ND
S301 = SWITCH: 6*6*4.3 微动轻触开关贴片
U301 = MPU-6000: GYRO/ACCELEROMETER 6AXIS 24QFN; 3DR_PARTNO: ECM0834; DATASHEET: http://invensense.com/mems/gyro/documents/PS-MPU-6000A-00_v1.0.pdf; LINK: http://invensense.com/mems/gyro/mpu6000.html; MFGPN: MPU-6000; Supplier 1: Digi-Key; PARTNO: MPU-6000
U302 = MS5611-01BA: Board Mount Pressure Sensors; 3DR_PARTNO: ECM0835; Value: 10-1200mbar; DATASHEET: http://www.meas-spec.com/downloads/MS5611-01BA01.pdf; LINK: http://www.meas-spec.com/product/t_product.aspx?id=8503#; MFGPN: MS5611-01BA; PARTNO: MS5611-01BA; Supplier 1: Mouser
U303 = LT3469: IC AMP DVR W/REG 1.3MHZ TSOT23-8; 3DR_PARTNO: ECM0829; Value: BUZZER; Supplier 1: Digi-Key

## Sheet power.SchDoc: myA4
size A4; Date: 2018/03/30; DrawnBy: 亓岳鑫; Organization: Altium Limited; Address1: 3 Minna Close; Address2: Belrose; Address3: NSW 2085; Address4: Australia; DocumentNumber: 2; Revision: Alfa 2.0; SheetNumber: 2; SheetTotal: 6; Time: 17:30
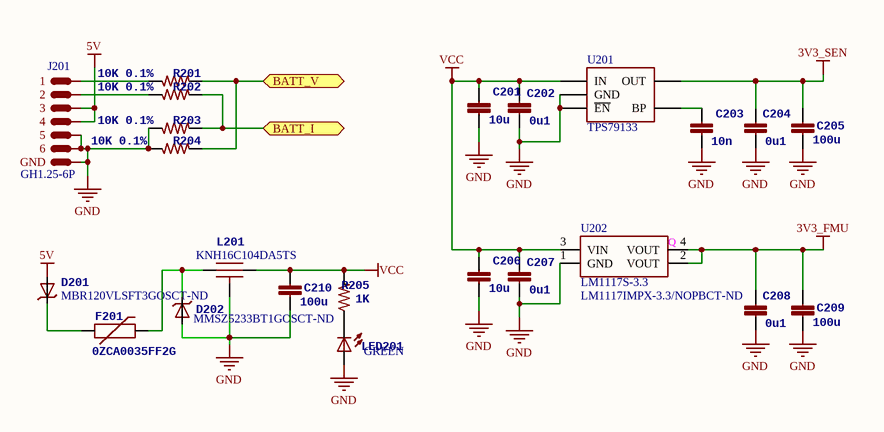
[diagram p3: power.SchDoc]

### Parts
C201  10u  [0805-CAP]
C202  0u1  [0603-CAP]
C203  10n  [0603-CAP]
C204  0u1  [0603-CAP]
C205  100u  [1206-CAP]
C206  10u  [0805-CAP]
C207  0u1  [0603-CAP]
C208  0u1  [0603-CAP]
C209  100u  [1206-CAP]
C210  100u  [1206-CAP]
D201  Supplier Part Number 1: MBR120VLSFT3GOSCT-ND  [SOD-123LF]  (hidden comment: MBR120VLSFT3GOSCT)
D202  Supplier Part Number 1: MMSZ5233BT1GOSCT-ND  [SOD-123LF]  (hidden comment: MMSZ5233BT1G)
F201  0ZCA0035FF2G  [1206-FUSE]
J201  GH1.25-6P  [1.25-6P]
L201  KNH16C104DA5TS  [0603-KNH16-DA]
LED201  Color: GREEN  [0603-LED]  (hidden comment: APG1608CGKC)
R201  10K 0.1%  [0603-RES]
R202  10K 0.1%  [0603-RES]
R203  10K 0.1%  [0603-RES]
R204  10K 0.1%  [0603-RES]
R205  1K  [0603-RES]
U201  TPS79133  [R-PDSO-G5]
U202  LM1117S-3.3  Supplier Part Number 1: LM1117IMPX-3.3/NOPBCT-ND  [SOT223-4N]

### Ports
BATT_I, BATT_V

### Nets
3V3_FMU: C208.P$1 C209.P$1 U202.2(VOUT) U202.4(VOUT)
3V3_SEN: C204.P$1 C205.P$1 U201.5(OUT)
5V: D201.A J201.3 J201.4
GND: C201.P$2 C202.P$2 C203.P$2 C204.P$2 C205.P$2 C206.P$2 C207.P$2 C208.P$2 C209.P$2 C210.P$2 D202.A J201.5 J201.6 J201.GND L201.GND LED201.A R203.1 R204.1 U201.2(GND) U201.3(~{EN}) U202.1(GND)
VCC: C201.P$1 C202.P$1 C206.P$1 C207.P$1 C210.P$1 L201.P$2 R205.2 U201.1(IN) U202.3(VIN)
NetC203_P$1: C203.P$1 U201.4(BP)
NetD201_C: D201.C F201.1
NetD202_C: D202.C F201.2 L201.P$1
NetJ201_1: J201.1 R201.1
NetJ201_2: J201.2 R202.1
NetLED201_C: LED201.C R205.1
NetR201_2: R201.2 R204.2 ; port BATT_V
NetR202_2: R202.2 R203.2 ; port BATT_I

### Notes on the sheet
- Title:
- Drawn by:
- Date:
- @
- Sheet:
- /
- (in symbol LDO-LM1117S-3.3) Q

### Library data of the parts
C201 C206 = CAP0805-10uF: Capacitor, 10uF, 10V, Y5V, 0805, Ceramic; PARTNO: CC0805ZKY5V6BB106; 3DR_PARTNO: ECM0713; Value: 10u; Supplier 1: Digi-Key; Supplier Part Number 1: 311-1355-1-ND
C202 C204 C207 C208 = CAP0603-0.1uF: as C405 on sheet fmu; Value: 0u1; Supplier 1: Digi-Key; Supplier Part Number 1: 311-1776-1-ND
C203 = CAP0603-10nF: as C301 on sheet sensors; Value: 10n
C205 C209 C210 = CAP1206-100uF: CAP CER 100UF 10V 20% X5R 1206; PARTNO: C3216X5R1A107M160AC; 3DR_PARTNO: ECM0716; Value: 100U; Supplier 1: Digi-Key; Supplier Part Number 1: 445-6007-1-ND
D201 = DIODE-SBD_SOD123FL: DIODE SCHOTTKY 20V 1A , 0.34V, SOD123FL; Value: 20V 1A; Supplier 1: Digi-Key
D202 = DIODE-ZENER: DIODE ZENER 6V 500MW SOD123; Value: 40v; 说明: 数目多的话参考PESD0402-140 等芯片; Supplier 1: Digi-Key
F201 = FUSE-1206: PTC RESTTBLE 0.35A 16V CHIP 1206, 自恢复保险; 3DR_PARTNO: ECM0802; PARTNO: 0ZCA0035FF2G; Supplier 1: Digi-Key; Value: 0.35A; Supplier Part Number 1: 507-1479-1-ND
J201 = GH1.25-6P: GH1.25mm 立贴 间距1.25mm 连接器贴片
L201 = EMI Filters: EMI FILTER CAP 0.1UF 2A 25V 0603; 3DR_PARTNO: ECM0719; Value: 0u1; Supplier 1: Digi-Key; PARTNO: KNH16C104DA5TS
LED201 = LED0603-GREEN: 2.1v, LED GREEN CLEAR 0603 SMD; 3DR_PARTNO: ECM0515; PARTNO: APG1608CGKC; Supplier 1: Digi-Key; Supplier Part Number 1: 754-1357-1-ND
R201-R204 = RES0603-10k_0.1%: RES 10 OHM 1/10W 0.1% 0603; Value: 10K 0.1%; Supplier 1: Digi-Key; Supplier Part Number 1: P10KDBCT-ND
R205 = RES0603-1K: RES 1K OHM 1/10W 5% 0603; Value: 1K; Supplier 1: Digi-Key; Supplier Part Number 1: 311-1.0KGRCT-ND
U201 = LDO-TPS79133: Supplier 1: Digi-Key; Supplier Part Number 1: 296-11866-1-ND
U202 = LDO-LM1117S-3.3: LDO, ouput 3.3V/1A, 0.04% Line Regulation and 0.1% load Regulation.; Supplier 1: Digi-Key

## Sheet connector_3v3 .SchDoc: myA4
size A4; Date: 2018/03/30; DrawnBy: 亓岳鑫; Organization: Altium Limited; Address1: 3 Minna Close; Address2: Belrose; Address3: NSW 2085; Address4: Australia; DocumentNumber: 5; Revision: Alfa 2.0; SheetNumber: 5; SheetTotal: 6; Time: 17:30
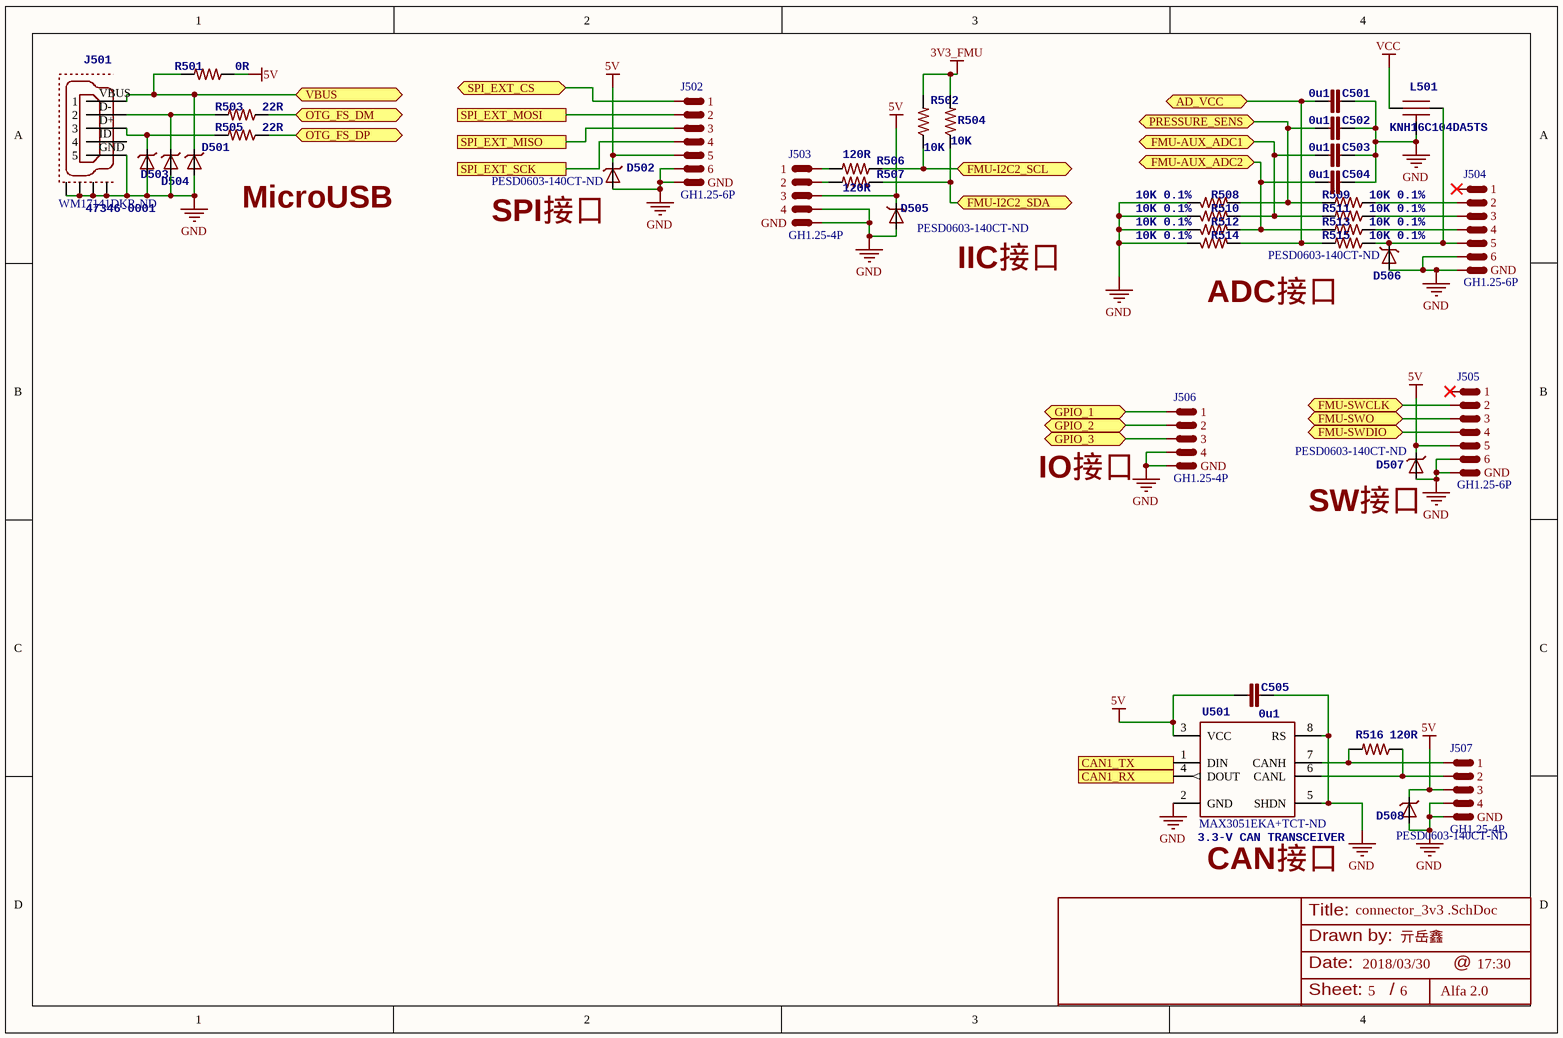
[diagram p4: connector_3v3 .SchDoc]

### Parts
C501  0u1  [0603-CAP]
C502  0u1  [0603-CAP]
C503  0u1  [0603-CAP]
C504  0u1  [0603-CAP]
C505  0u1  [0603-CAP]
D501  PESD0603-140  [0603-ESD]  (value not drawn)
D502  Supplier Part Number 1: PESD0603-140CT-ND  [0603-ESD]  (hidden comment: PESD0603-140)
D503  PESD0603-140  [0603-ESD]  (value not drawn)
D504  PESD0603-140  [0603-ESD]  (value not drawn)
D505  Supplier Part Number 1: PESD0603-140CT-ND  [0603-ESD]  (hidden comment: PESD0603-140)
D506  Supplier Part Number 1: PESD0603-140CT-ND  [0603-ESD]  (hidden comment: PESD0603-140)
D507  Supplier Part Number 1: PESD0603-140CT-ND  [0603-ESD]  (hidden comment: PESD0603-140)
D508  Supplier Part Number 1: PESD0603-140CT-ND  [0603-ESD]  (hidden comment: PESD0603-140)
J501  47346-0001  Supplier Part Number 1: WM17141DKR-ND  [MOLEX-47346-0001]
J502  GH1.25-6P  [1.25-6P]
J503  GH1.25-4P  [1.25-4P]
J504  GH1.25-6P  [1.25-6P]
J505  GH1.25-6P  [1.25-6P]
J506  GH1.25-4P  [1.25-4P]
J507  GH1.25-4P  [1.25-4P]
L501  KNH16C104DA5TS  [0603-KNH16-DA]
R501  0R  [0603-RES]
R502  10K  [0603-RES]
R503  22R  [0603-RES]
R504  10K  [0603-RES]
R505  22R  [0603-RES]
R506  120R  [0603-RES]
R507  120R  [0603-RES]
R508  10K 0.1%  [0603-RES]
R509  10K 0.1%  [0603-RES]
R510  10K 0.1%  [0603-RES]
R511  10K 0.1%  [0603-RES]
R512  10K 0.1%  [0603-RES]
R513  10K 0.1%  [0603-RES]
R514  10K 0.1%  [0603-RES]
R515  10K 0.1%  [0603-RES]
R516  120R  [0603-RES]
U501  3.3-V CAN TRANSCEIVER  Supplier Part Number 1: MAX3051EKA+TCT-ND  [SOT23-8]

### Ports
AD_VCC, CAN1_RX, CAN1_TX, FMU-AUX_ADC1, FMU-AUX_ADC2, FMU-I2C2_SCL, FMU-I2C2_SDA, FMU-SWCLK, FMU-SWDIO, FMU-SWO, GPIO_1, GPIO_2, GPIO_3, OTG_FS_DM, OTG_FS_DP, PRESSURE_SENS, SPI_EXT_CS, SPI_EXT_MISO, SPI_EXT_MOSI, SPI_EXT_SCK, VBUS

### Nets
3V3_FMU: R502.2 R504.2
5V: C505.P$1 D502.C D505.C D507.C D508.C J502.5 J503.3 J505.5 J507.3 R501.1 U501.3(VCC)
GND: C501.P$2 C502.P$2 C503.P$2 C504.P$2 C505.P$2 D501.A D502.A D503.A D504.A D505.A D506.A D507.A D508.A J501.GND(5) J501.GND1 J501.GND2 J501.GND3 J501.GND4 J502.6 J502.GND J503.4 J503.GND J504.6 J504.GND J505.6 J505.GND J506.4 J506.GND J507.4 J507.GND L501.GND R508.1 R510.1 R512.1 R514.1 U501.2(GND) U501.5(SHDN) U501.8(RS)
VCC: L501.P$1
NetC501_P$1: C501.P$1 R514.2 R515.2 ; port AD_VCC
NetC502_P$1: C502.P$1 R508.2 R509.2 ; port PRESSURE_SENS
NetC503_P$1: C503.P$1 R510.2 R511.2 ; port FMU-AUX_ADC1
NetC504_P$1: C504.P$1 R512.2 R513.2 ; port FMU-AUX_ADC2
NetD501_C: D501.C J501.VBUS(1) R501.2 ; port VBUS
NetD503_C: D503.C J501.D+(3) R505.2
NetD504_C: D504.C J501.D-(2) R503.2
NetD506_C: D506.C J504.5 L501.P$2 R515.1
NetJ502_1: J502.1 ; port SPI_EXT_CS
NetJ502_2: J502.2 ; port SPI_EXT_MOSI
NetJ502_3: J502.3 ; port SPI_EXT_MISO
NetJ502_4: J502.4 ; port SPI_EXT_SCK
NetJ503_1: J503.1 R506.2
NetJ503_2: J503.2 R507.2
NetJ504_2: J504.2 R509.1
NetJ504_3: J504.3 R511.1
NetJ504_4: J504.4 R513.1
NetJ505_2: J505.2 ; port FMU-SWCLK
NetJ505_3: J505.3 ; port FMU-SWO
NetJ505_4: J505.4 ; port FMU-SWDIO
NetJ506_1: J506.1 ; port GPIO_1
NetJ506_2: J506.2 ; port GPIO_2
NetJ506_3: J506.3 ; port GPIO_3
NetJ507_1: J507.1 R516.2 U501.7(CANH)
NetJ507_2: J507.2 R516.1 U501.6(CANL)
NetR502_1: R502.1 R506.1 ; port FMU-I2C2_SCL
NetR503_1: R503.1 ; port OTG_FS_DM
NetR504_1: R504.1 R507.1 ; port FMU-I2C2_SDA
NetR505_1: R505.1 ; port OTG_FS_DP
NetU401_81: U501.4(DOUT) ; port CAN1_RX
NetU401_82: U501.1(DIN) ; port CAN1_TX

Not connected (* = marked no-connect by the designer): J501 ID(4); J504 1*; J505 1*

### Notes on the sheet
- MicroUSB
- (near D502) SPI接口
- IIC接口
- ADC接口
- IO接口
- (near D507) SW接口
- (near U501) CAN接口
- Title:
- Drawn by:
- Date:
- @
- Sheet:
- /

### Library data of the parts
C501-C505 = CAP0603-0.1uF: as C405 on sheet fmu; Value: 0u1; Supplier 1: Digi-Key; Supplier Part Number 1: 311-1776-1-ND
D501-D508 = DIODE-ESD: TVS DIODE 14V 0603; Supplier 1: Digi-Key
  D501 D503 D504: Supplier Part Number 1: PESD0603-140CT-ND
J501 = MicroUSB: MICRO USB B, BOTTOM MOUNT; 3DR_PARTNO: ECM0486; PARTNO: 0473460001; Supplier 1: Digi-Key
J502 J504 J505 = GH1.25-6P: GH1.25mm 立贴 间距1.25mm 连接器贴片
J503 J506 J507 = GH1.25-4P: GH1.25mm 立贴 间距1.25mm 连接器贴片
L501 = EMI Filters: as L201 on sheet power; Supplier 1: Digi-Key; PARTNO: KNH16C104DA5TS
R501 = RES0603-0R: RES 0R OHM 1/10W 5% 0603; Value: 0R; Supplier 1: Digi-Key; Supplier Part Number 1: 311-100DCT-ND
R502 R504 = RES0603-10K: RES 10K OHM 1/10W 5% 0603; Value: 10K; Supplier 1: Digi-Key; Supplier Part Number 1: A126331TR-ND
R503 R505 = RES0603-22R: RES 22R OHM 1/10W 5% 0603; Value: 22R; Supplier 1: Digi-Key; Supplier Part Number 1: 311-220GRCT-ND
R506 R507 R516 = RES0603-120R: RES 120R OHM 1/10W 5% 0603; Value: 120R; Supplier 1: Digi-Key; Supplier Part Number 1: 311-120GRCT-ND
R508-R515 = RES0603-10k_0.1%: RES 10 OHM 1/10W 0.1% 0603; Value: 10K 0.1%; Supplier 1: Digi-Key; Supplier Part Number 1: P10KDBCT-ND
U501 = MAX3051: IC TXRX CAN 1MBPS SOT23-8; 3DR_PARTNO: ECM0831; PARTNO: MAX3051EKA+T; Supplier 1: Digi-Key; Value: CAN

## Sheet connerctor_3-5v.SchDoc: myA4
size A4; Date: 2018/03/30; DrawnBy: 亓岳鑫; Organization: Altium Limited; Address1: 3 Minna Close; Address2: Belrose; Address3: NSW 2085; Address4: Australia; DocumentNumber: 6; Revision: Alfa 2.0; SheetNumber: 6; SheetTotal: 6; Time: 17:30
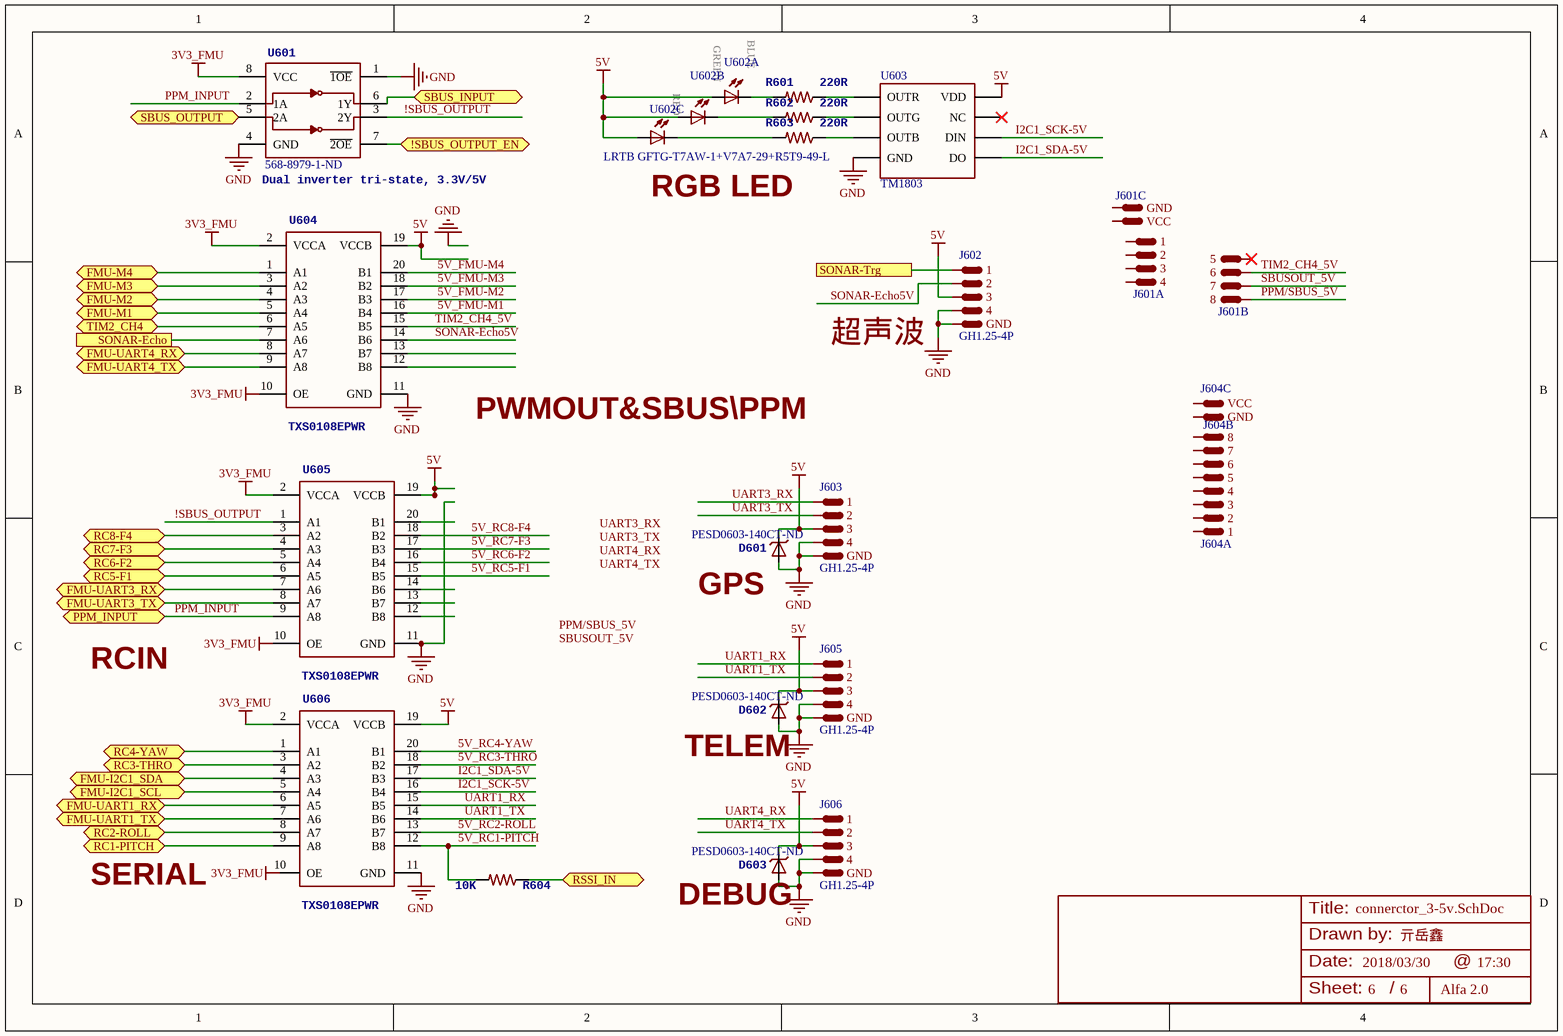
[diagram p5: connerctor_3-5v.SchDoc]

### Parts
D601  Supplier Part Number 1: PESD0603-140CT-ND  [0603-ESD]  (hidden comment: PESD0603-140)
D602  Supplier Part Number 1: PESD0603-140CT-ND  [0603-ESD]  (hidden comment: PESD0603-140)
D603  Supplier Part Number 1: PESD0603-140CT-ND  [0603-ESD]  (hidden comment: PESD0603-140)
J601  JR 3X8  [JR3X8]  (value not drawn)  (parts A,B,C of 3)
J602  GH1.25-4P  [1.25-4P]
J603  GH1.25-4P  [1.25-4P]
J604  JR 3X8  [JR3X8]  (value not drawn)  (parts A,B,C of 3)
J605  GH1.25-4P  [1.25-4P]
J606  GH1.25-4P  [1.25-4P]
R601  220R  [0603-RES]
R602  220R  [0603-RES]
R603  220R  [0603-RES]
R604  10K  [0603-RES]
U601  Dual inverter tri-state, 3.3V/5V  Supplier Part Number 1: 568-8979-1-ND  [TSSOP8_SOT505-2]
U602  LRTB GFTG-T7AW-1+V7A7-29+R5T9-49-L  [P-LCC-6]  (parts A,B,C of 3)
U603  TM1803  [SO08]
U604  TXS0108EPWR  [SOP65P640-20N]
U605  TXS0108EPWR  [SOP65P640-20N]
U606  TXS0108EPWR  [SOP65P640-20N]

### Ports
!SBUS_OUTPUT_EN, FMU-I2C1_SCL, FMU-I2C1_SDA, FMU-M1, FMU-M2, FMU-M3, FMU-M4, FMU-UART1_RX, FMU-UART1_TX, FMU-UART3_RX, FMU-UART3_TX, FMU-UART4_RX, FMU-UART4_TX, PPM_INPUT, RC1-PITCH, RC2-ROLL, RC3-THRO, RC4-YAW, RC5-F1, RC6-F2, RC7-F3, RC8-F4, RSSI_IN, SBUS_INPUT, SBUS_OUTPUT, SONAR-Echo, SONAR-Trg, TIM2_CH4

### Nets
3V3_FMU: U601.8(VCC) U604.2(VCCA) U604.10(OE) U605.2(VCCA) U605.10(OE) U606.2(VCCA)
5V: D601.C D602.C D603.C J602.3 J603.3 J605.3 J606.3 U602.A1(A) U602.A2(A) U602.A3(A) U603.8(VDD) U604.19(VCCB) U605.19(VCCB) U606.19(VCCB)
GND: D601.A D602.A D603.A J602.4 J602.GND J603.4 J603.GND J605.4 J605.GND J606.4 J606.GND U601.1(~{1OE}) U601.4(GND) U603.4(GND) U604.11(GND) U605.11(GND) U606.11(GND)
5V_FMU-M1: U604.16(B4)
5V_FMU-M2: U604.17(B3)
5V_FMU-M3: U604.18(B2)
5V_FMU-M4: U604.20(B1)
5V_RC1-PITCH: R604.2 U606.12(B8)
5V_RC2-ROLL: U606.13(B7)
5V_RC3-THRO: U606.18(B2)
5V_RC4-YAW: U606.20(B1)
5V_RC5-F1: U605.15(B5)
5V_RC6-F2: U605.16(B4)
5V_RC7-F3: U605.17(B3)
5V_RC8-F4: U605.18(B2)
!SBUS_OUTPUT: U601.3(2Y) U605.1(A1)
I2C1_SCK-5V: U603.6(DIN) U606.16(B4)
I2C1_SDA-5V: U603.5(DO) U606.17(B3)
PPM/SBUS_5V: J601.8
PPM_INPUT: U601.2(1A) U605.9(A8) ; port PPM_INPUT
SBUSOUT_5V: J601.7
SONAR-Echo5V: J602.2 U604.14(B6)
TIM2_CH4_5V: J601.6 U604.15(B5)
UART1_RX: J605.1 U606.15(B5)
UART1_TX: J605.2 U606.14(B6)
UART3_RX: J603.1
UART3_TX: J603.2
UART4_RX: J606.1
UART4_TX: J606.2
NetJ602_1: J602.1 ; port SONAR-Trg
NetR601_1: R601.1 U603.1(OUTR)
NetR601_2: R601.2 U602.C1(C)
NetR602_1: R602.1 U603.2(OUTG)
NetR602_2: R602.2 U602.C2(C)
NetR603_1: R603.1 U603.3(OUTB)
NetR603_2: R603.2 U602.C3(C)
NetR604_1: R604.1 ; port RSSI_IN
NetU401_23: U604.9(A8) ; port FMU-UART4_TX
NetU401_24: U604.8(A7) ; port FMU-UART4_RX
NetU401_25: U604.7(A6) ; port SONAR-Echo
NetU401_26: U604.6(A5) ; port TIM2_CH4
NetU401_35: U606.3(A2) ; port RC3-THRO
NetU401_36: U606.1(A1) ; port RC4-YAW
NetU401_40: U604.5(A4) ; port FMU-M1
NetU401_42: U604.4(A3) ; port FMU-M2
NetU401_44: U604.3(A2) ; port FMU-M3
NetU401_45: U604.1(A1) ; port FMU-M4
NetU401_55: U605.8(A7) ; port FMU-UART3_TX
NetU401_56: U605.7(A6) ; port FMU-UART3_RX
NetU401_59: U605.6(A5) ; port RC5-F1
NetU401_60: U605.5(A4) ; port RC6-F2
NetU401_61: U605.4(A3) ; port RC7-F3
NetU401_62: U605.3(A2) ; port RC8-F4
NetU401_84: U601.7(~{2OE}) ; port !SBUS_OUTPUT_EN
NetU401_86: U601.5(2A) ; port SBUS_OUTPUT
NetU401_87: U601.6(1Y) ; port SBUS_INPUT
NetU401_90: U606.9(A8) ; port RC1-PITCH
NetU401_91: U606.8(A7) ; port RC2-ROLL
NetU401_92: U606.7(A6) ; port FMU-UART1_TX
NetU401_93: U606.6(A5) ; port FMU-UART1_RX
NetU401_95: U606.5(A4) ; port FMU-I2C1_SCL
NetU401_96: U606.4(A3) ; port FMU-I2C1_SDA

Not connected (* = marked no-connect by the designer): J601 1 2 3 4 5* GND VCC; J604 1 2 3 4 5 6 7 8 GND VCC; U603 7(NC)*; U604 12(B8) 13(B7); U605 12(B8) 13(B7) 14(B6) 20(B1); U606 10(OE)

### Notes on the sheet
- RGB LED
- 超声波
- PWMOUT&SBUS\PPM
- (near D601) GPS
- RCIN
- (near D602) TELEM
- SERIAL
- (near D603) DEBUG
- Labels drawn without touching a wire or pin: 3V3_FMU, PPM/SBUS_5V, SBUSOUT_5V, UART3_RX, UART3_TX, UART4_RX, UART4_TX
- Title:
- Drawn by:
- Date:
- @
- Sheet:
- /
- (in symbol LED-RGB, part A) BLUE
- (in symbol LED-RGB, part B) GREEN
- (in symbol LED-RGB, part C) RED

### Library data of the parts
D601-D603 = DIODE-ESD: TVS DIODE 14V 0603; Supplier 1: Digi-Key
J601 J604 = JR 3X8: Header 3X8 pins
J602 J603 J605 J606 = GH1.25-4P: GH1.25mm 立贴 间距1.25mm 连接器贴片
R601-R603 = RES0603-220R: RES 220R OHM 1/10W 5% 0603; Value: 220R; Supplier 1: Digi-Key; Supplier Part Number 1: 311-220GRCT-ND
R604 = RES0603-10K: RES 10K OHM 1/10W 5% 0603; Value: 10K; Supplier 1: Digi-Key; Supplier Part Number 1: A126331TR-ND
U601 = 74LVC2G240-TSSOP-8: IC INVERTER DUAL 4-INPUT 8TSSOP; 3DR_PARTNO: ECM0817; PARTNO: 74LVC2G240DP,125; Value: INV; Supplier 1: Digi-Key
U602 = LED-RGB: Muti LEDs
U603 = LED_DRV-TM1803: 3-Channel Constant-Current LED Driver
U604-U606 = TXS0108EPWR: IC XLATR VOLT-LVL 8B BDIR 20SOP; Supplier 1: Digi-Key; Supplier Part Number 1: 296-23011-1-ND

## Nets that join several sheets
3V3_FMU: top (3V3_FMU.P$1), fmu (21 pins), sensors (R301.2), power (C208.P$1 C209.P$1 U202.2 U202.4), connector_3v3  (R502.2 R504.2), connerctor_3-5v (6 pins)
3V3_SEN: top (3V3_SEN.P$1), sensors (5 pins), power (C204.P$1 C205.P$1 U201.5)
5V: top (5V.P$1), sensors (C306.P$1 L301.1 U303.3), power (D201.A J201.3 J201.4), connector_3v3  (11 pins), connerctor_3-5v (14 pins)
GND: top (GND.P$1), fmu (20 pins), sensors (17 pins), power (21 pins), connector_3v3  (38 pins), connerctor_3-5v (17 pins)
VCC: top (VCC.P$1), sensors (LED301.A LED302.A), power (9 pins), connector_3v3  (L501.P$1)
NetC501_P$1: fmu (U401.17), connector_3v3  (C501.P$1 R514.2 R515.2)
NetC502_P$1: fmu (U401.18), connector_3v3  (C502.P$1 R508.2 R509.2)
NetC503_P$1: fmu (U401.33), connector_3v3  (C503.P$1 R510.2 R511.2)
NetC504_P$1: fmu (U401.34), connector_3v3  (C504.P$1 R512.2 R513.2)
NetD501_C: fmu (U401.68), connector_3v3  (D501.C J501.VBUS R501.2)
NetJ502_1: fmu (U401.98), connector_3v3  (J502.1)
NetJ502_2: fmu (U401.5), connector_3v3  (J502.2)
NetJ502_3: fmu (U401.4), connector_3v3  (J502.3)
NetJ502_4: fmu (U401.1), connector_3v3  (J502.4)
NetJ505_2: fmu (U401.76), connector_3v3  (J505.2)
NetJ505_3: fmu (U401.89), connector_3v3  (J505.3)
NetJ505_4: fmu (U401.72), connector_3v3  (J505.4)
NetJ506_1: fmu (U401.7), connector_3v3  (J506.1)
NetJ506_2: fmu (U401.8), connector_3v3  (J506.2)
NetJ506_3: fmu (U401.9), connector_3v3  (J506.3)
NetJ602_1: fmu (U401.29), connerctor_3-5v (J602.1)
NetR201_2: fmu (U401.15), power (R201.2 R204.2)
NetR202_2: fmu (U401.16), power (R202.2 R203.2)
NetR301_1: fmu (U401.97), sensors (R301.1 S301.1 S301.2)
NetR302_1: fmu (U401.88), sensors (R302.1)
NetR303_1: fmu (U401.85), sensors (R303.1)
NetR306_2: fmu (U401.77), sensors (R306.2)
NetR502_1: fmu (U401.47), connector_3v3  (R502.1 R506.1)
NetR503_1: fmu (U401.70), connector_3v3  (R503.1)
NetR504_1: fmu (U401.48), connector_3v3  (R504.1 R507.1)
NetR505_1: fmu (U401.71), connector_3v3  (R505.1)
NetR604_1: fmu (U401.64), connerctor_3-5v (R604.1)
NetU301_8: fmu (U401.58), sensors (U301.8)
NetU302_5: fmu (U401.57), sensors (U302.5)
NetU401_23: fmu (U401.23), connerctor_3-5v (U604.9)
NetU401_24: fmu (U401.24), connerctor_3-5v (U604.8)
NetU401_25: fmu (U401.25), connerctor_3-5v (U604.7)
NetU401_26: fmu (U401.26), connerctor_3-5v (U604.6)
NetU401_35: fmu (U401.35), connerctor_3-5v (U606.3)
NetU401_36: fmu (U401.36), connerctor_3-5v (U606.1)
NetU401_40: fmu (U401.40), connerctor_3-5v (U604.5)
NetU401_42: fmu (U401.42), connerctor_3-5v (U604.4)
NetU401_44: fmu (U401.44), connerctor_3-5v (U604.3)
NetU401_45: fmu (U401.45), connerctor_3-5v (U604.1)
NetU401_55: fmu (U401.55), connerctor_3-5v (U605.8)
NetU401_56: fmu (U401.56), connerctor_3-5v (U605.7)
NetU401_59: fmu (U401.59), connerctor_3-5v (U605.6)
NetU401_60: fmu (U401.60), connerctor_3-5v (U605.5)
NetU401_61: fmu (U401.61), connerctor_3-5v (U605.4)
NetU401_62: fmu (U401.62), connerctor_3-5v (U605.3)
NetU401_81: fmu (U401.81), connector_3v3  (U501.4)
NetU401_82: fmu (U401.82), connector_3v3  (U501.1)
NetU401_84: fmu (U401.84), connerctor_3-5v (U601.7)
NetU401_86: fmu (U401.86), connerctor_3-5v (U601.5)
NetU401_87: fmu (U401.87), connerctor_3-5v (U601.6)
NetU401_90: fmu (U401.90), connerctor_3-5v (U606.9)
NetU401_91: fmu (U401.91), connerctor_3-5v (U606.8)
NetU401_92: fmu (U401.92), connerctor_3-5v (U606.7)
NetU401_93: fmu (U401.93), connerctor_3-5v (U606.6)
NetU401_95: fmu (U401.95), connerctor_3-5v (U606.5)
NetU401_96: fmu (U401.96), connerctor_3-5v (U606.4)
PPM_INPUT: fmu (U401.63), connerctor_3-5v (U601.2 U605.9)
SPI1_MISO: fmu (U401.30), sensors (U301.9 U302.6)
SPI1_MOSI: fmu (U401.32), sensors (U301.24 U302.7)
SPI1_SCK: fmu (U401.31), sensors (U301.23 U302.8)